# Altium project MiniDisplay.PrjPCB
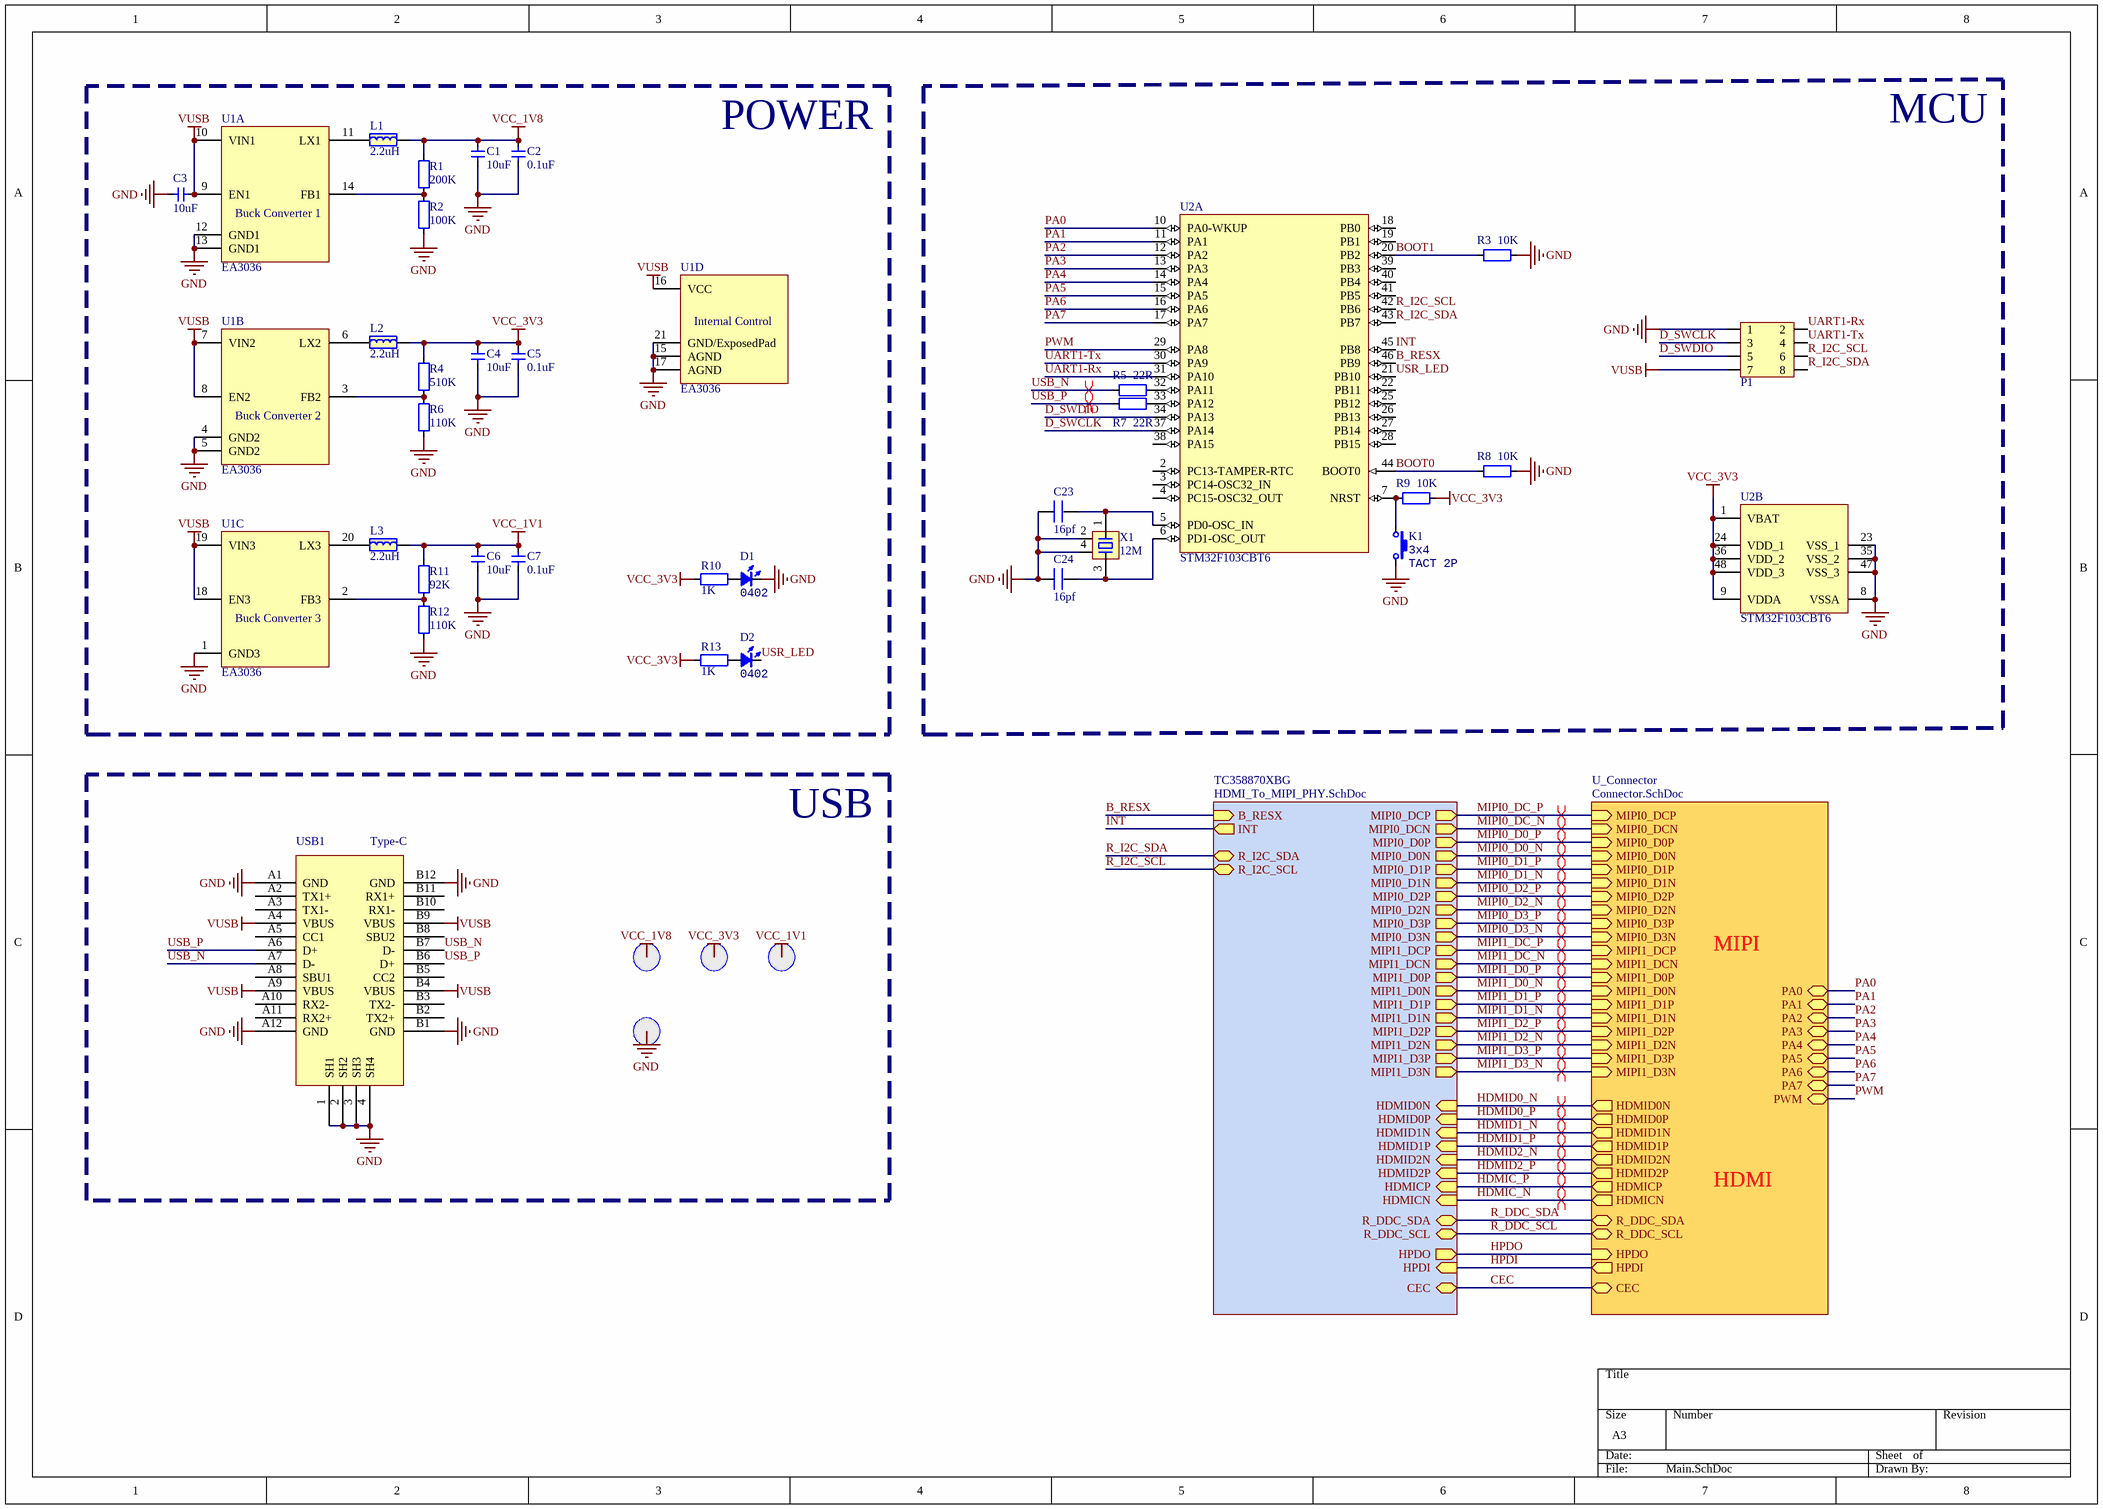
[diagram p0: Main.SchDoc]
3 sheets, 81 parts. Net scope: hierarchical (ports join the sheet entries above them; power ports are global).
Board file: MiniDisplay.PcbDoc
Sheets:
  Main.SchDoc
    TC358870XBG = HDMI_To_MIPI_PHY.SchDoc
    U_Connector = Connector.SchDoc

## Sheet Main.SchDoc
size A3

### Parts
C1  10uF  [CAP_0402]
C2  0.1uF  [CAP_0402]
C3  10uF  [CAP_0402]
C4  10uF  [CAP_0402]
C5  0.1uF  [CAP_0402]
C6  10uF  [CAP_0402]
C7  0.1uF  [CAP_0402]
C23  16pf  [0603_CAP]
C24  16pf  [0603_CAP]
D1  Type: 0402  [SMDLED-0603]  (hidden comment: color?)
D2  Type: 0402  [SMDLED-0603]  (hidden comment: color?)
K1  value 3x4  [ButtonTACT_3x4x2_180H]  (hidden comment: TACT 2P)
L1  2.2uH  [2520-L]
L2  2.2uH  [2520-L]
L3  2.2uH  [2520-L]
P1  HDR2x4_2.54  [HDR2X4_2.54_180H]  (value not drawn)
R1  200K  [RES_0402]
R2  100K  [RES_0402]
R3  10K  [RES_0402]
R4  510K  [RES_0402]
R5  22R  [RES_0402]
R6  110K  [RES_0402]
R7  22R  [RES_0402]
R8  10K  [RES_0402]
R9  10K  [RES_0402]
R10  1K  [RES_0402]
R11  92K  [RES_0402]
R12  110K  [RES_0402]
R13  1K  [RES_0402]
T1  测试点  [TEST_PT]  (value not drawn)
T2  测试点  [TEST_PT]  (value not drawn)
T3  测试点  [TEST_PT]  (value not drawn)
T4  测试点  [TEST_PT]  (value not drawn)
U1  EA3036  [QFN-20]  (parts A,B,C,D of 4)
U2  STM32F103CBT6  [LQFP-48]  (parts A,B of 2)
USB1  Type-C  [Type-C-TOP]
X1  12M  [XTAL3225]

### Blocks framed on the sheet
POWER: C1-C7 D1 D2 L1-L3 R1 R2 R4 R6 R10-R13 U1
MCU: C23 C24 K1 P1 R3 R5 R7-R9 U2 X1

### Sub-sheets
TC358870XBG = HDMI_To_MIPI_PHY.SchDoc: B_RESX (in), INT (out), R_I2C_SDA (bidir), R_I2C_SCL (bidir), HPDI (in), HPDO (out), HDMID0N (in), HDMID0P (in), HDMID1N (in), HDMID1P (in), HDMID2N (in), HDMID2P (in), HDMICP (in), HDMICN (in), CEC (bidir), R_DDC_SDA (bidir), R_DDC_SCL (bidir), MIPI0_DCP (out), MIPI0_DCN (out), MIPI0_D0P (out), MIPI0_D0N (out), MIPI0_D1P (out), MIPI0_D1N (out), MIPI0_D2P (out), MIPI0_D2N (out), MIPI0_D3P (out), MIPI0_D3N (out), MIPI1_DCP (out), MIPI1_DCN (out), MIPI1_D0P (out), MIPI1_D0N (out), MIPI1_D1P (out), MIPI1_D1N (out), MIPI1_D2P (out), MIPI1_D2N (out), MIPI1_D3P (out), MIPI1_D3N (out)
U_Connector = Connector.SchDoc: MIPI0_DCP (in), MIPI0_DCN (in), MIPI0_D0P (in), MIPI0_D0N (in), MIPI0_D1P (in), MIPI0_D1N (in), MIPI0_D2P (in), MIPI0_D2N (in), MIPI0_D3P (in), MIPI0_D3N (in), MIPI1_DCP (in), MIPI1_DCN (in), MIPI1_D0P (in), MIPI1_D0N (in), MIPI1_D1P (in), MIPI1_D1N (in), MIPI1_D2P (in), MIPI1_D2N (in), MIPI1_D3P (in), MIPI1_D3N (in), HDMID0P (out), CEC (bidir), HDMICN (out), HDMID2P (out), HPDI (out), HPDO (in), HDMID0N (out), HDMID2N (out), HDMID1N (out), HDMID1P (out), HDMICP (out), R_DDC_SDA (bidir), R_DDC_SCL (bidir), PA5 (bidir), PWM (bidir), PA6 (bidir), PA7 (bidir), PA3 (bidir), PA4 (bidir), PA2 (bidir), PA1 (bidir), PA0 (bidir)

### Nets
GND: C1.1 C2.2 C3.1 C4.1 C5.2 C6.1 C7.2 C23.2 C24.2 D1.2(K) K1.2 P1.1 R2.1 R3.2 R6.1 R8.2 R12.1 T4.0 U1.1(GND3) U1.4(GND2) U1.5(GND2) U1.12(GND1) U1.13(GND1) U1.15(AGND) U1.17(AGND) U1.21(GND/ExposedPad) U2.8(VSSA) U2.23(VSS_1) U2.35(VSS_2) U2.47(VSS_3) USB1.1(SH1) USB1.2(SH2) USB1.3(SH3) USB1.4(SH4) USB1.A1(GND) USB1.A12(GND) USB1.B1(GND) USB1.B12(GND) X1.2 X1.4
VCC_1V1: C6.2 C7.1 L3.2 R11.2 T3.0
VCC_1V8: C1.2 C2.1 L1.2 R1.2 T1.0
VCC_3V3: C4.2 C5.1 L2.2 R4.2 R9.2 R10.1 R13.1 T2.0 U2.1(VBAT) U2.9(VDDA) U2.24(VDD_1) U2.36(VDD_2) U2.48(VDD_3)
VUSB: C3.2 P1.7 U1.7(VIN2) U1.8(EN2) U1.9(EN1) U1.10(VIN1) U1.16(VCC) U1.18(EN3) U1.19(VIN3) USB1.A4(VBUS) USB1.A9(VBUS) USB1.B4(VBUS) USB1.B9(VBUS)
B_RESX: U2.46(PB9) ; sheet TC358870XBG/B_RESX
BOOT0: R8.1 U2.44(BOOT0)
BOOT1: R3.1 U2.20(PB2)
CEC: sheet TC358870XBG/CEC, sheet U_Connector/CEC
D_SWCLK: P1.3 U2.37(PA14)
D_SWDIO: P1.5 U2.34(PA13)
HDMIC_N: sheet TC358870XBG/HDMICN, sheet U_Connector/HDMICN
HDMIC_P: sheet TC358870XBG/HDMICP, sheet U_Connector/HDMICP
HDMID0_N: sheet TC358870XBG/HDMID0N, sheet U_Connector/HDMID0N
HDMID0_P: sheet TC358870XBG/HDMID0P, sheet U_Connector/HDMID0P
HDMID1_N: sheet TC358870XBG/HDMID1N, sheet U_Connector/HDMID1N
HDMID1_P: sheet TC358870XBG/HDMID1P, sheet U_Connector/HDMID1P
HDMID2_N: sheet TC358870XBG/HDMID2N, sheet U_Connector/HDMID2N
HDMID2_P: sheet TC358870XBG/HDMID2P, sheet U_Connector/HDMID2P
HPDI: sheet TC358870XBG/HPDI, sheet U_Connector/HPDI
HPDO: sheet TC358870XBG/HPDO, sheet U_Connector/HPDO
INT: U2.45(PB8) ; sheet TC358870XBG/INT
MIPI0_D0_N: sheet TC358870XBG/MIPI0_D0N, sheet U_Connector/MIPI0_D0N
MIPI0_D0_P: sheet TC358870XBG/MIPI0_D0P, sheet U_Connector/MIPI0_D0P
MIPI0_D1_N: sheet TC358870XBG/MIPI0_D1N, sheet U_Connector/MIPI0_D1N
MIPI0_D1_P: sheet TC358870XBG/MIPI0_D1P, sheet U_Connector/MIPI0_D1P
MIPI0_D2_N: sheet TC358870XBG/MIPI0_D2N, sheet U_Connector/MIPI0_D2N
MIPI0_D2_P: sheet TC358870XBG/MIPI0_D2P, sheet U_Connector/MIPI0_D2P
MIPI0_D3_N: sheet TC358870XBG/MIPI0_D3N, sheet U_Connector/MIPI0_D3N
MIPI0_D3_P: sheet TC358870XBG/MIPI0_D3P, sheet U_Connector/MIPI0_D3P
MIPI0_DC_N: sheet TC358870XBG/MIPI0_DCN, sheet U_Connector/MIPI0_DCN
MIPI0_DC_P: sheet TC358870XBG/MIPI0_DCP, sheet U_Connector/MIPI0_DCP
MIPI1_D0_N: sheet TC358870XBG/MIPI1_D0N, sheet U_Connector/MIPI1_D0N
MIPI1_D0_P: sheet TC358870XBG/MIPI1_D0P, sheet U_Connector/MIPI1_D0P
MIPI1_D1_N: sheet TC358870XBG/MIPI1_D1N, sheet U_Connector/MIPI1_D1N
MIPI1_D1_P: sheet TC358870XBG/MIPI1_D1P, sheet U_Connector/MIPI1_D1P
MIPI1_D2_N: sheet TC358870XBG/MIPI1_D2N, sheet U_Connector/MIPI1_D2N
MIPI1_D2_P: sheet TC358870XBG/MIPI1_D2P, sheet U_Connector/MIPI1_D2P
MIPI1_D3_N: sheet TC358870XBG/MIPI1_D3N, sheet U_Connector/MIPI1_D3N
MIPI1_D3_P: sheet TC358870XBG/MIPI1_D3P, sheet U_Connector/MIPI1_D3P
MIPI1_DC_N: sheet TC358870XBG/MIPI1_DCN, sheet U_Connector/MIPI1_DCN
MIPI1_DC_P: sheet TC358870XBG/MIPI1_DCP, sheet U_Connector/MIPI1_DCP
PA0: U2.10(PA0-WKUP) ; sheet U_Connector/PA0
PA1: U2.11(PA1) ; sheet U_Connector/PA1
PA2: U2.12(PA2) ; sheet U_Connector/PA2
PA3: U2.13(PA3) ; sheet U_Connector/PA3
PA4: U2.14(PA4) ; sheet U_Connector/PA4
PA5: U2.15(PA5) ; sheet U_Connector/PA5
PA6: U2.16(PA6) ; sheet U_Connector/PA6
PA7: U2.17(PA7) ; sheet U_Connector/PA7
PWM: U2.29(PA8) ; sheet U_Connector/PWM
R_DDC_SCL: sheet TC358870XBG/R_DDC_SCL, sheet U_Connector/R_DDC_SCL
R_DDC_SDA: sheet TC358870XBG/R_DDC_SDA, sheet U_Connector/R_DDC_SDA
R_I2C_SCL: P1.6 U2.42(PB6) ; sheet TC358870XBG/R_I2C_SCL
R_I2C_SDA: P1.8 U2.43(PB7) ; sheet TC358870XBG/R_I2C_SDA
UART1-Rx: P1.2 U2.31(PA10)
UART1-Tx: P1.4 U2.30(PA9)
USB_N: R5.1 USB1.A7(D-) USB1.B7(D-)
USB_P: R7.1 USB1.A6(D+) USB1.B6(D+)
USR_LED: D2.2(K) U2.21(PB10)
NetC23_1: C23.1 U2.5(PD0-OSC_IN) X1.1
NetC24_1: C24.1 U2.6(PD1-OSC_OUT) X1.3
NetD1_1: D1.1(A) R10.2
NetD2_1: D2.1(A) R13.2
NetK1_1: K1.1 R9.1 U2.7(NRST)
NetL1_1: L1.1 U1.11(LX1)
NetL2_1: L2.1 U1.6(LX2)
NetL3_1: L3.1 U1.20(LX3)
NetR1_1: R1.1 R2.2 U1.14(FB1)
NetR4_1: R4.1 R6.2 U1.3(FB2)
NetR5_2: R5.2 U2.32(PA11)
NetR7_2: R7.2 U2.33(PA12)
NetR11_1: R11.1 R12.2 U1.2(FB3)

Not connected (* = marked no-connect by the designer): U2 2(PC13-TAMPER-RTC) 3(PC14-OSC32_IN) 4(PC15-OSC32_OUT) 18(PB0) 19(PB1) 22(PB11) 25(PB12) 26(PB13) 27(PB14) 28(PB15) 38(PA15) 39(PB3) 40(PB4) 41(PB5); USB1 A2(TX1+) A3(TX1-) A5(CC1) A8(SBU1) A10(RX2-) A11(RX2+) B2(TX2+) B3(TX2-) B5(CC2) B8(SBU2) B10(RX1-) B11(RX1+)

### Layout directives
differential pair: HDMIC_N, HDMIC_P, HDMID0_N, HDMID0_P, HDMID1_N, HDMID1_P, HDMID2_N, HDMID2_P, MIPI0_D0_N, MIPI0_D0_P, MIPI0_D1_N, MIPI0_D1_P, MIPI0_D2_N, MIPI0_D2_P, MIPI0_D3_N, MIPI0_D3_P, MIPI0_DC_N, MIPI0_DC_P, MIPI1_D0_N, MIPI1_D0_P, MIPI1_D1_N, MIPI1_D1_P, MIPI1_D2_N, MIPI1_D2_P, MIPI1_D3_N, MIPI1_D3_P, MIPI1_DC_N, MIPI1_DC_P, USB_N, USB_P

### Notes on the sheet
- USB
- MIPI
- HDMI
- (in symbol EA3036, part A) Buck Converter 1
- (in symbol EA3036, part B) Buck Converter 2
- (in symbol EA3036, part C) Buck Converter 3
- (in symbol EA3036, part D) Internal Control

### Library data of the parts
C1-C7 = 电容-0402: Capacitor; Value: 0.1u
C23 C24 = C
D1 D2 = LED_0402: LED; Value: color?
K1 = ButtonTACT_3x4x2_180: Button; type: TACT 2P
L1-L3 = 电感-2520: 磁珠
P1 = HDR2x4_2.54: Header
R1-R4 R6 R8-R13 = 电阻-0402: Resistor; Value: 22R
R5 R7 = 电阻-0402: Resistor; Value: 22R
U1 = EA3036: EA3036 is a 3CH power management IC for applications powered by one Li-Ion battery or a DC 5V adapter.
U2 = STM32F103CBT6: ARM Cortex-M3 32-bit MCU, 128 KB Flash, 20 KB Internal RAM, 37 I/Os, 48-pin LQFP, -40 to 85 degC, Tray; A/D Converter: 2x12-bit (10 Channel); FLASH Size (Prog) (kB): 128; I/Os (High Current): 37; Internal RAM Size (kB): 20; Operating Frequency(F) (Processor speed) (MHz): 72; Supply Voltage(Vcc) min (V): 2; DatasheetVersion: Rev. 16; PackageVersion: Rev. 6, 06/2013; PackageReference: LQFP48; PackageDescription: 48-Pin Low Profile Quad Flat Package, 7 x 7 mm Body, 0.5 mm Pitch; Supplier 1: Digi-Key; Supplier Part Number 1: 497-6288-ND; Supplier 2: Farnell; Supplier Part Number 2: 1606327; Core: ARM Cortex-M3; Packing: Tray; Mounting Technology: Surface Mount; PartNumber: STM32F103CBT6; ComponentLink1Description: Manufacturer URL; ComponentLink1URL: http://www.st.com/web/en/home.html; ComponentLink2Description: Datasheet; ComponentLink2URL: http://www.st.com/st-web-ui/static/active/en/resource/technical/document/datasheet/CD00161566.pdf; ComponentLink3Description: Package Specification; ComponentLink3URL: http://www.st.com/st-web-ui/static/active/en/resource/technical/document/datasheet/DM00058181.pdf; Supplier 3: Newark; Supplier Part Number 3: 11N8296; Supplier 4: Newark; Supplier Part Number 4: 57P1214; Supplier 5: Mouser; Supplier Part Number 5: 511-STM32F103CBT6
USB1 = USB-Type-C-TOP
X1 = XTAL-4P: 4脚无源晶振; 版权归属: 源创客; BOM名称: 4脚无源晶振; 学习资源: www.ooocke.com

## Sheet HDMI_To_MIPI_PHY.SchDoc
size A4
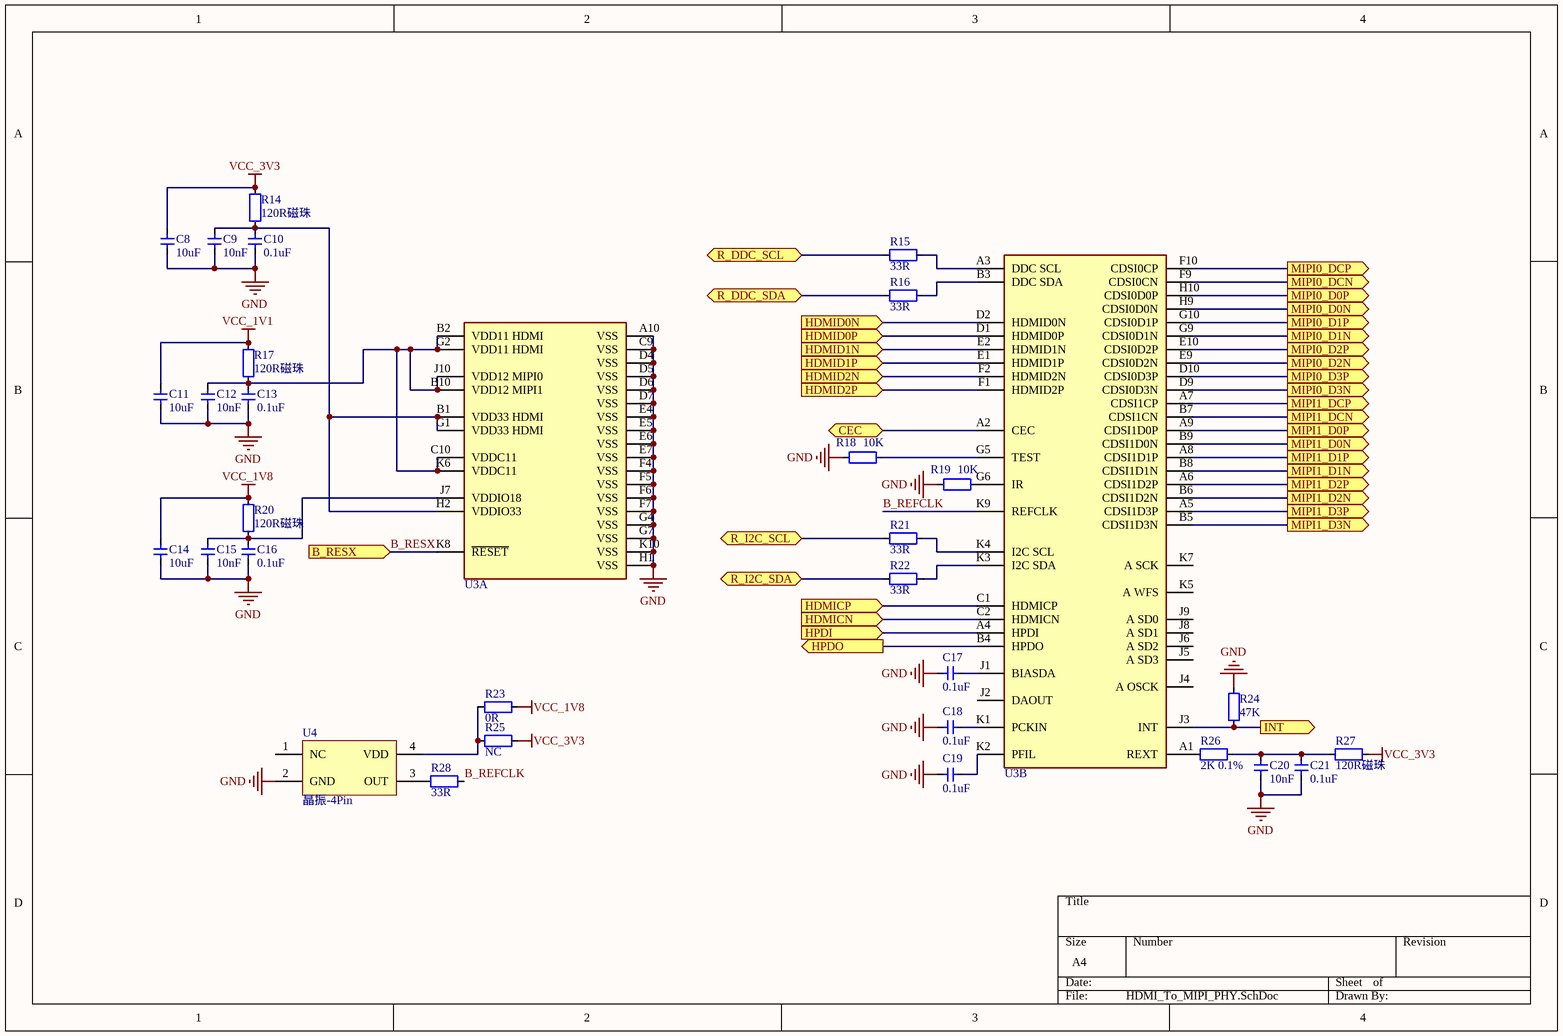
[diagram p1: HDMI_To_MIPI_PHY.SchDoc]

### Parts
C8  10uF  [CAP_0402]
C9  10nF  [CAP_0402]
C10  0.1uF  [CAP_0402]
C11  10uF  [CAP_0402]
C12  10nF  [CAP_0402]
C13  0.1uF  [CAP_0402]
C14  10uF  [CAP_0402]
C15  10nF  [CAP_0402]
C16  0.1uF  [CAP_0402]
C17  0.1uF  [CAP_0402]
C18  0.1uF  [CAP_0402]
C19  0.1uF  [CAP_0402]
C20  10nF  [CAP_0402]
C21  0.1uF  [CAP_0402]
R14  120R磁珠  [0603_RES]
R15  33R  [RES_0402]
R16  33R  [RES_0402]
R17  120R磁珠  [0603_RES]
R18  10K  [RES_0402]
R19  10K  [RES_0402]
R20  120R磁珠  [0603_RES]
R21  33R  [RES_0402]
R22  33R  [RES_0402]
R23  0R  [RES_0402]
R24  47K  [RES_0402]
R25  NC  [RES_0402]
R26  2K 0.1%  [RES_0402]
R27  120R磁珠  [0603_RES]
R28  33R  [RES_0402]
U3  TC358870XBG  [VFBGA-80]  (value not drawn)  (parts A,B of 2)
U4  晶振-4Pin  [晶振2520]

### Ports
B_RESX (in), CEC (bidir), HDMICN (in), HDMICP (in), HDMID0N (in), HDMID0P (in), HDMID1N (in), HDMID1P (in), HDMID2N (in), HDMID2P (in), HPDI (in), HPDO (out), INT (out), MIPI0_D0N (out), MIPI0_D0P (out), MIPI0_D1N (out), MIPI0_D1P (out), MIPI0_D2N (out), MIPI0_D2P (out), MIPI0_D3N (out), MIPI0_D3P (out), MIPI0_DCN (out), MIPI0_DCP (out), MIPI1_D0N (out), MIPI1_D0P (out), MIPI1_D1N (out), MIPI1_D1P (out), MIPI1_D2N (out), MIPI1_D2P (out), MIPI1_D3N (out), MIPI1_D3P (out), MIPI1_DCN (out), MIPI1_DCP (out), R_DDC_SCL (bidir), R_DDC_SDA (bidir), R_I2C_SCL (bidir), R_I2C_SDA (bidir)

### Nets
GND: C8.1 C9.1 C10.1 C11.1 C12.1 C13.1 C14.1 C15.1 C16.1 C17.2 C18.2 C19.2 C20.1 C21.1 R18.1 R19.1 R24.2 U3.A10(VSS) U3.C9(VSS) U3.D4(VSS) U3.D5(VSS) U3.D6(VSS) U3.D7(VSS) U3.E4(VSS) U3.E5(VSS) U3.E6(VSS) U3.E7(VSS) U3.F4(VSS) U3.F5(VSS) U3.F6(VSS) U3.F7(VSS) U3.G4(VSS) U3.G7(VSS) U3.H1(VSS) U3.K10(VSS) U4.2(GND)
VCC_1V1: C11.2 R17.2
VCC_1V8: C14.2 R20.2 R23.2
VCC_3V3: C8.2 R14.2 R25.2 R27.2
B_REFCLK: R28.2 U3.K9(REFCLK)
B_RESX: U3.K8(~{RESET}) ; port B_RESX
CEC: U3.A2(CEC) ; port CEC
HDMIC_N: U3.C2(HDMICN) ; port HDMICN
HDMIC_P: U3.C1(HDMICP) ; port HDMICP
HDMID0_N: U3.D2(HDMID0N) ; port HDMID0N
HDMID0_P: U3.D1(HDMID0P) ; port HDMID0P
HDMID1_N: U3.E2(HDMID1N) ; port HDMID1N
HDMID1_P: U3.E1(HDMID1P) ; port HDMID1P
HDMID2_N: U3.F2(HDMID2N) ; port HDMID2N
HDMID2_P: U3.F1(HDMID2P) ; port HDMID2P
HPDI: U3.A4(HPDI) ; port HPDI
HPDO: U3.B4(HPDO) ; port HPDO
INT: R24.1 U3.J3(INT) ; port INT
MIPI0_D0_N: U3.H9(CDSI0D0N) ; port MIPI0_D0N
MIPI0_D0_P: U3.H10(CDSI0D0P) ; port MIPI0_D0P
MIPI0_D1_N: U3.G9(CDSI0D1N) ; port MIPI0_D1N
MIPI0_D1_P: U3.G10(CDSI0D1P) ; port MIPI0_D1P
MIPI0_D2_N: U3.E9(CDSI0D2N) ; port MIPI0_D2N
MIPI0_D2_P: U3.E10(CDSI0D2P) ; port MIPI0_D2P
MIPI0_D3_N: U3.D9(CDSI0D3N) ; port MIPI0_D3N
MIPI0_D3_P: U3.D10(CDSI0D3P) ; port MIPI0_D3P
MIPI0_DC_N: U3.F9(CDSI0CN) ; port MIPI0_DCN
MIPI0_DC_P: U3.F10(CDSI0CP) ; port MIPI0_DCP
MIPI1_D0_N: U3.B9(CDSI1D0N) ; port MIPI1_D0N
MIPI1_D0_P: U3.A9(CDSI1D0P) ; port MIPI1_D0P
MIPI1_D1_N: U3.B8(CDSI1D1N) ; port MIPI1_D1N
MIPI1_D1_P: U3.A8(CDSI1D1P) ; port MIPI1_D1P
MIPI1_D2_N: U3.B6(CDSI1D2N) ; port MIPI1_D2N
MIPI1_D2_P: U3.A6(CDSI1D2P) ; port MIPI1_D2P
MIPI1_D3_N: U3.B5(CDSI1D3N) ; port MIPI1_D3N
MIPI1_D3_P: U3.A5(CDSI1D3P) ; port MIPI1_D3P
MIPI1_DC_N: U3.B7(CDSI1CN) ; port MIPI1_DCN
MIPI1_DC_P: U3.A7(CDSI1CP) ; port MIPI1_DCP
R_DDC_SCL: R15.1 ; port R_DDC_SCL
R_DDC_SDA: R16.1 ; port R_DDC_SDA
R_I2C_SCL: R21.1 ; port R_I2C_SCL
R_I2C_SDA: R22.1 ; port R_I2C_SDA
NetC9_2: C9.2 C10.2 R14.1 U3.B1(VDD33_HDMI) U3.G1(VDD33_HDMI) U3.H2(VDDIO33)
NetC12_2: C12.2 C13.2 R17.1 U3.B2(VDD11_HDMI) U3.B10(VDD12_MIPI1) U3.C10(VDDC11) U3.G2(VDD11_HDMI) U3.J10(VDD12_MIPI0) U3.K6(VDDC11)
NetC15_2: C15.2 C16.2 R20.1 U3.J7(VDDIO18)
NetC17_1: C17.1 U3.J1(BIASDA)
NetC18_1: C18.1 U3.K1(PCKIN)
NetC19_1: C19.1 U3.K2(PFIL)
NetC20_2: C20.2 C21.2 R26.2 R27.1
NetR15_2: R15.2 U3.A3(DDC_SCL)
NetR16_2: R16.2 U3.B3(DDC_SDA)
NetR18_2: R18.2 U3.G5(TEST)
NetR19_2: R19.2 U3.G6(IR)
NetR21_2: R21.2 U3.K4(I2C_SCL)
NetR22_2: R22.2 U3.K3(I2C_SDA)
NetR23_1: R23.1 R25.1 U4.4(VDD)
NetR26_1: R26.1 U3.A1(REXT)
NetR28_1: R28.1 U4.3(OUT)

Not connected (* = marked no-connect by the designer): U3 J2(DAOUT) J4(A_OSCK) J5(A_SD3) J6(A_SD2) J8(A_SD1) J9(A_SD0) K5(A_WFS) K7(A_SCK); U4 1(NC)

### Library data of the parts
C8-C21 = 电容-0402: Capacitor; Value: 0.1u
R14 R17 R20 R27 = 电阻-0805: Resistor; Value: 22R
R15 R16 R18 R19 R21-R26 R28 = 电阻-0402: Resistor; Value: 22R
U4 = 晶振-4Pin: 5032 有源

## Sheet Connector.SchDoc
size A3
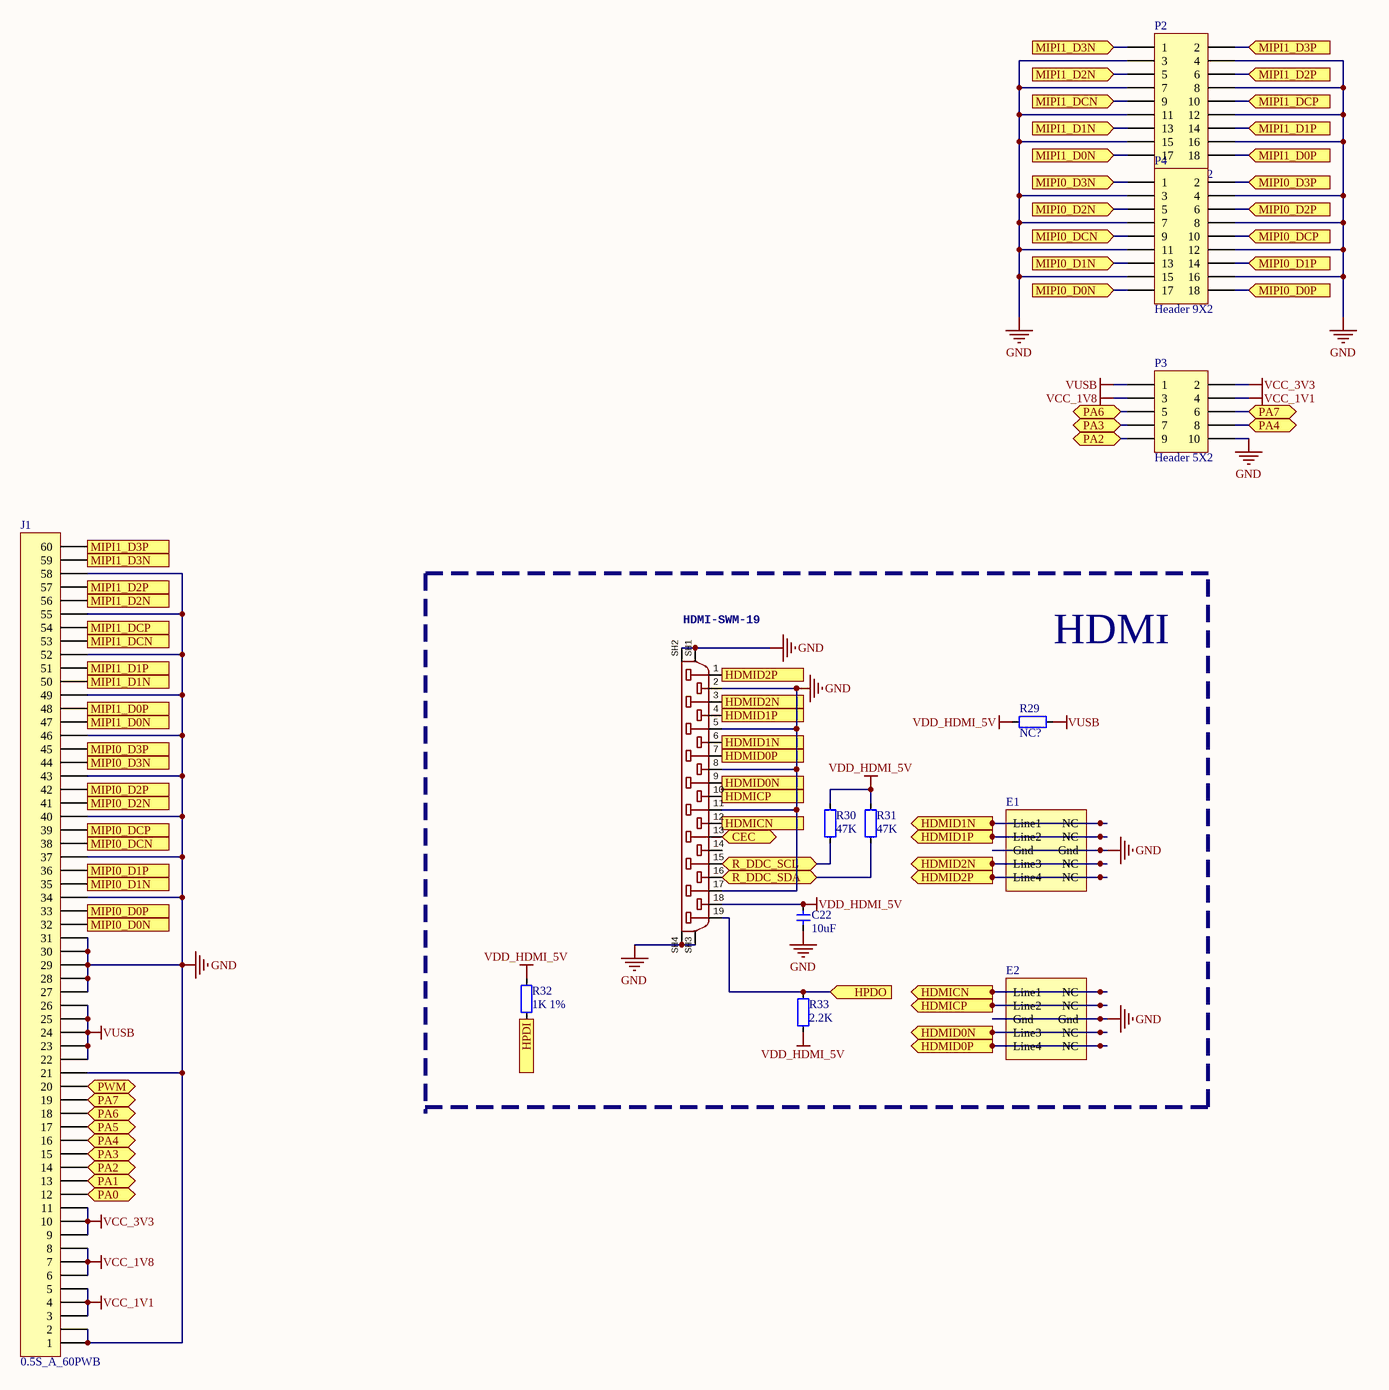
[diagram p2: Connector.SchDoc]

### Parts
C22  10uF  [CAP_0402]
E1  E?  [DFN-2510]  (value not drawn)
E2  E?  [DFN-2510]  (value not drawn)
HDMI?  HDMI-SWM-19  [HDMI-SWM-19]
J1  0.5S_A_60PWB  [FFC_0.5_60]
P2  Header 9X2  [HDR2X9]
P3  Header 5X2  [HDR2X5]
P4  Header 9X2  [HDR2X9]
R29  NC?  [RES_0402]
R30  47K  [RES_0402]
R31  47K  [RES_0402]
R32  1K 1%  [RES_0402]
R33  2.2K  [RES_0402]

### Ports
CEC (bidir), HDMICN (out), HDMICP (out), HDMID0N (out), HDMID0P (out), HDMID1N (out), HDMID1P (out), HDMID2N (out), HDMID2P (out), HPDI (out), HPDO (in), MIPI0_D0N (in), MIPI0_D0P (in), MIPI0_D1N (in), MIPI0_D1P (in), MIPI0_D2N (in), MIPI0_D2P (in), MIPI0_D3N (in), MIPI0_D3P (in), MIPI0_DCN (in), MIPI0_DCP (in), MIPI1_D0N (in), MIPI1_D0P (in), MIPI1_D1N (in), MIPI1_D1P (in), MIPI1_D2N (in), MIPI1_D2P (in), MIPI1_D3N (in), MIPI1_D3P (in), MIPI1_DCN (in), MIPI1_DCP (in), PA0 (bidir), PA1 (bidir), PA2 (bidir), PA3 (bidir), PA4 (bidir), PA5 (bidir), PA6 (bidir), PA7 (bidir), PWM (bidir), R_DDC_SCL (bidir), R_DDC_SDA (bidir)

### Nets
GND: C22.1 E1.3(Gnd) E1.8(Gnd) E2.3(Gnd) E2.8(Gnd) HDMI?.2 HDMI?.5 HDMI?.8 HDMI?.11 HDMI?.17 HDMI?.SH1 HDMI?.SH2 HDMI?.SH3 HDMI?.SH4 J1.1 J1.2 J1.21 J1.27 J1.28 J1.29 J1.30 J1.31 J1.34 J1.37 J1.40 J1.43 J1.46 J1.49 J1.52 J1.55 J1.58 P2.3 P2.4 P2.7 P2.8 P2.11 P2.12 P2.15 P2.16 P3.10 P4.3 P4.4 P4.7 P4.8 P4.11 P4.12 P4.15 P4.16
VCC_1V1: J1.3 J1.4 J1.5 P3.4
VCC_1V8: J1.6 J1.7 J1.8 P3.3
VCC_3V3: J1.9 J1.10 J1.11 P3.2
VDD_HDMI_5V: C22.2 HDMI?.18 R29.2 R30.2 R31.2 R32.2 R33.1
VUSB: J1.22 J1.23 J1.24 J1.25 J1.26 P3.1 R29.1
CEC: HDMI?.13 ; port CEC
HDMIC_N: E2.1(Line1) E2.10(NC) HDMI?.12 ; port HDMICN
HDMIC_P: E2.2(Line2) E2.9(NC) HDMI?.10 ; port HDMICP
HDMID0_N: E2.4(Line3) E2.7(NC) HDMI?.9 ; port HDMID0N
HDMID0_P: E2.5(Line4) E2.6(NC) HDMI?.7 ; port HDMID0P
HDMID1_N: E1.1(Line1) E1.10(NC) HDMI?.6 ; port HDMID1N
HDMID1_P: E1.2(Line2) E1.9(NC) HDMI?.4 ; port HDMID1P
HDMID2_N: E1.4(Line3) E1.7(NC) HDMI?.3 ; port HDMID2N
HDMID2_P: E1.5(Line4) E1.6(NC) HDMI?.1 ; port HDMID2P
HPDI: R32.1 ; port HPDI
HPDO: HDMI?.19 R33.2 ; port HPDO
MIPI0_D0_N: J1.32 P4.17 ; port MIPI0_D0N
MIPI0_D0_P: J1.33 P4.18 ; port MIPI0_D0P
MIPI0_D1_N: J1.35 P4.13 ; port MIPI0_D1N
MIPI0_D1_P: J1.36 P4.14 ; port MIPI0_D1P
MIPI0_D2_N: J1.41 P4.5 ; port MIPI0_D2N
MIPI0_D2_P: J1.42 P4.6 ; port MIPI0_D2P
MIPI0_D3_N: J1.44 P4.1 ; port MIPI0_D3N
MIPI0_D3_P: J1.45 P4.2 ; port MIPI0_D3P
MIPI0_DC_N: J1.38 P4.9 ; port MIPI0_DCN
MIPI0_DC_P: J1.39 P4.10 ; port MIPI0_DCP
MIPI1_D0_N: J1.47 P2.17 ; port MIPI1_D0N
MIPI1_D0_P: J1.48 P2.18 ; port MIPI1_D0P
MIPI1_D1_N: J1.50 P2.13 ; port MIPI1_D1N
MIPI1_D1_P: J1.51 P2.14 ; port MIPI1_D1P
MIPI1_D2_N: J1.56 P2.5 ; port MIPI1_D2N
MIPI1_D2_P: J1.57 P2.6 ; port MIPI1_D2P
MIPI1_D3_N: J1.59 P2.1 ; port MIPI1_D3N
MIPI1_D3_P: J1.60 P2.2 ; port MIPI1_D3P
MIPI1_DC_N: J1.53 P2.9 ; port MIPI1_DCN
MIPI1_DC_P: J1.54 P2.10 ; port MIPI1_DCP
PA0: J1.12 ; port PA0
PA1: J1.13 ; port PA1
PA2: J1.14 P3.9 ; port PA2
PA3: J1.15 P3.7 ; port PA3
PA4: J1.16 P3.8 ; port PA4
PA5: J1.17 ; port PA5
PA6: J1.18 P3.5 ; port PA6
PA7: J1.19 P3.6 ; port PA7
PWM: J1.20 ; port PWM
R_DDC_SCL: HDMI?.15 R30.1 ; port R_DDC_SCL
R_DDC_SDA: HDMI?.16 R31.1 ; port R_DDC_SDA

Not connected (* = marked no-connect by the designer): HDMI? 14

### Notes on the sheet
- HDMI

### Library data of the parts
C22 = 电容-0402: Capacitor; Value: 0.1u
E1 E2 = AZ1045-04F
HDMI? = HDMI-MC34931HDMI-SWM-19
J1 = FPC60-0.5mm: Header, 60-Pin; LatestRevisionDate: 17-Jul-2002; LatestRevisionNote: Re-released for DXP Platform.; Publisher: Altium Limited
P2 P4 = Header 9X2: Header, 9-Pin, Dual row; LatestRevisionDate: 17-Jul-2002; LatestRevisionNote: Re-released for DXP Platform.; Publisher: Altium Limited
P3 = Header 5X2: Header, 5-Pin, Dual row; LatestRevisionDate: 17-Jul-2002; LatestRevisionNote: Re-released for DXP Platform.; Publisher: Altium Limited
R29-R33 = 电阻-0402: Resistor; Value: 22R

## Nets that join several sheets
GND: Main (40 pins), HDMI_To_MIPI_PHY (36 pins), Connector (48 pins)
VCC_1V1: Main (5 pins), HDMI_To_MIPI_PHY (C11.2 R17.2), Connector (J1.3 J1.4 J1.5 P3.4)
VCC_1V8: Main (5 pins), HDMI_To_MIPI_PHY (C14.2 R20.2 R23.2), Connector (J1.6 J1.7 J1.8 P3.3)
VCC_3V3: Main (13 pins), HDMI_To_MIPI_PHY (C8.2 R14.2 R25.2 R27.2), Connector (J1.9 J1.10 J1.11 P3.2)
VUSB: Main (13 pins), Connector (7 pins)
B_RESX: Main (U2.46), HDMI_To_MIPI_PHY (U3.K8)
CEC: HDMI_To_MIPI_PHY (U3.A2), Connector (HDMI?.13)
HDMIC_N: HDMI_To_MIPI_PHY (U3.C2), Connector (E2.1 E2.10 HDMI?.12)
HDMIC_P: HDMI_To_MIPI_PHY (U3.C1), Connector (E2.2 E2.9 HDMI?.10)
HDMID0_N: HDMI_To_MIPI_PHY (U3.D2), Connector (E2.4 E2.7 HDMI?.9)
HDMID0_P: HDMI_To_MIPI_PHY (U3.D1), Connector (E2.5 E2.6 HDMI?.7)
HDMID1_N: HDMI_To_MIPI_PHY (U3.E2), Connector (E1.1 E1.10 HDMI?.6)
HDMID1_P: HDMI_To_MIPI_PHY (U3.E1), Connector (E1.2 E1.9 HDMI?.4)
HDMID2_N: HDMI_To_MIPI_PHY (U3.F2), Connector (E1.4 E1.7 HDMI?.3)
HDMID2_P: HDMI_To_MIPI_PHY (U3.F1), Connector (E1.5 E1.6 HDMI?.1)
HPDI: HDMI_To_MIPI_PHY (U3.A4), Connector (R32.1)
HPDO: HDMI_To_MIPI_PHY (U3.B4), Connector (HDMI?.19 R33.2)
INT: Main (U2.45), HDMI_To_MIPI_PHY (R24.1 U3.J3)
MIPI0_D0_N: HDMI_To_MIPI_PHY (U3.H9), Connector (J1.32 P4.17)
MIPI0_D0_P: HDMI_To_MIPI_PHY (U3.H10), Connector (J1.33 P4.18)
MIPI0_D1_N: HDMI_To_MIPI_PHY (U3.G9), Connector (J1.35 P4.13)
MIPI0_D1_P: HDMI_To_MIPI_PHY (U3.G10), Connector (J1.36 P4.14)
MIPI0_D2_N: HDMI_To_MIPI_PHY (U3.E9), Connector (J1.41 P4.5)
MIPI0_D2_P: HDMI_To_MIPI_PHY (U3.E10), Connector (J1.42 P4.6)
MIPI0_D3_N: HDMI_To_MIPI_PHY (U3.D9), Connector (J1.44 P4.1)
MIPI0_D3_P: HDMI_To_MIPI_PHY (U3.D10), Connector (J1.45 P4.2)
MIPI0_DC_N: HDMI_To_MIPI_PHY (U3.F9), Connector (J1.38 P4.9)
MIPI0_DC_P: HDMI_To_MIPI_PHY (U3.F10), Connector (J1.39 P4.10)
MIPI1_D0_N: HDMI_To_MIPI_PHY (U3.B9), Connector (J1.47 P2.17)
MIPI1_D0_P: HDMI_To_MIPI_PHY (U3.A9), Connector (J1.48 P2.18)
MIPI1_D1_N: HDMI_To_MIPI_PHY (U3.B8), Connector (J1.50 P2.13)
MIPI1_D1_P: HDMI_To_MIPI_PHY (U3.A8), Connector (J1.51 P2.14)
MIPI1_D2_N: HDMI_To_MIPI_PHY (U3.B6), Connector (J1.56 P2.5)
MIPI1_D2_P: HDMI_To_MIPI_PHY (U3.A6), Connector (J1.57 P2.6)
MIPI1_D3_N: HDMI_To_MIPI_PHY (U3.B5), Connector (J1.59 P2.1)
MIPI1_D3_P: HDMI_To_MIPI_PHY (U3.A5), Connector (J1.60 P2.2)
MIPI1_DC_N: HDMI_To_MIPI_PHY (U3.B7), Connector (J1.53 P2.9)
MIPI1_DC_P: HDMI_To_MIPI_PHY (U3.A7), Connector (J1.54 P2.10)
PA0: Main (U2.10), Connector (J1.12)
PA1: Main (U2.11), Connector (J1.13)
PA2: Main (U2.12), Connector (J1.14 P3.9)
PA3: Main (U2.13), Connector (J1.15 P3.7)
PA4: Main (U2.14), Connector (J1.16 P3.8)
PA5: Main (U2.15), Connector (J1.17)
PA6: Main (U2.16), Connector (J1.18 P3.5)
PA7: Main (U2.17), Connector (J1.19 P3.6)
PWM: Main (U2.29), Connector (J1.20)
R_DDC_SCL: HDMI_To_MIPI_PHY (R15.1), Connector (HDMI?.15 R30.1)
R_DDC_SDA: HDMI_To_MIPI_PHY (R16.1), Connector (HDMI?.16 R31.1)
R_I2C_SCL: Main (P1.6 U2.42), HDMI_To_MIPI_PHY (R21.1)
R_I2C_SDA: Main (P1.8 U2.43), HDMI_To_MIPI_PHY (R22.1)